# Altium schematic sheet ARD.SchDoc
size A4
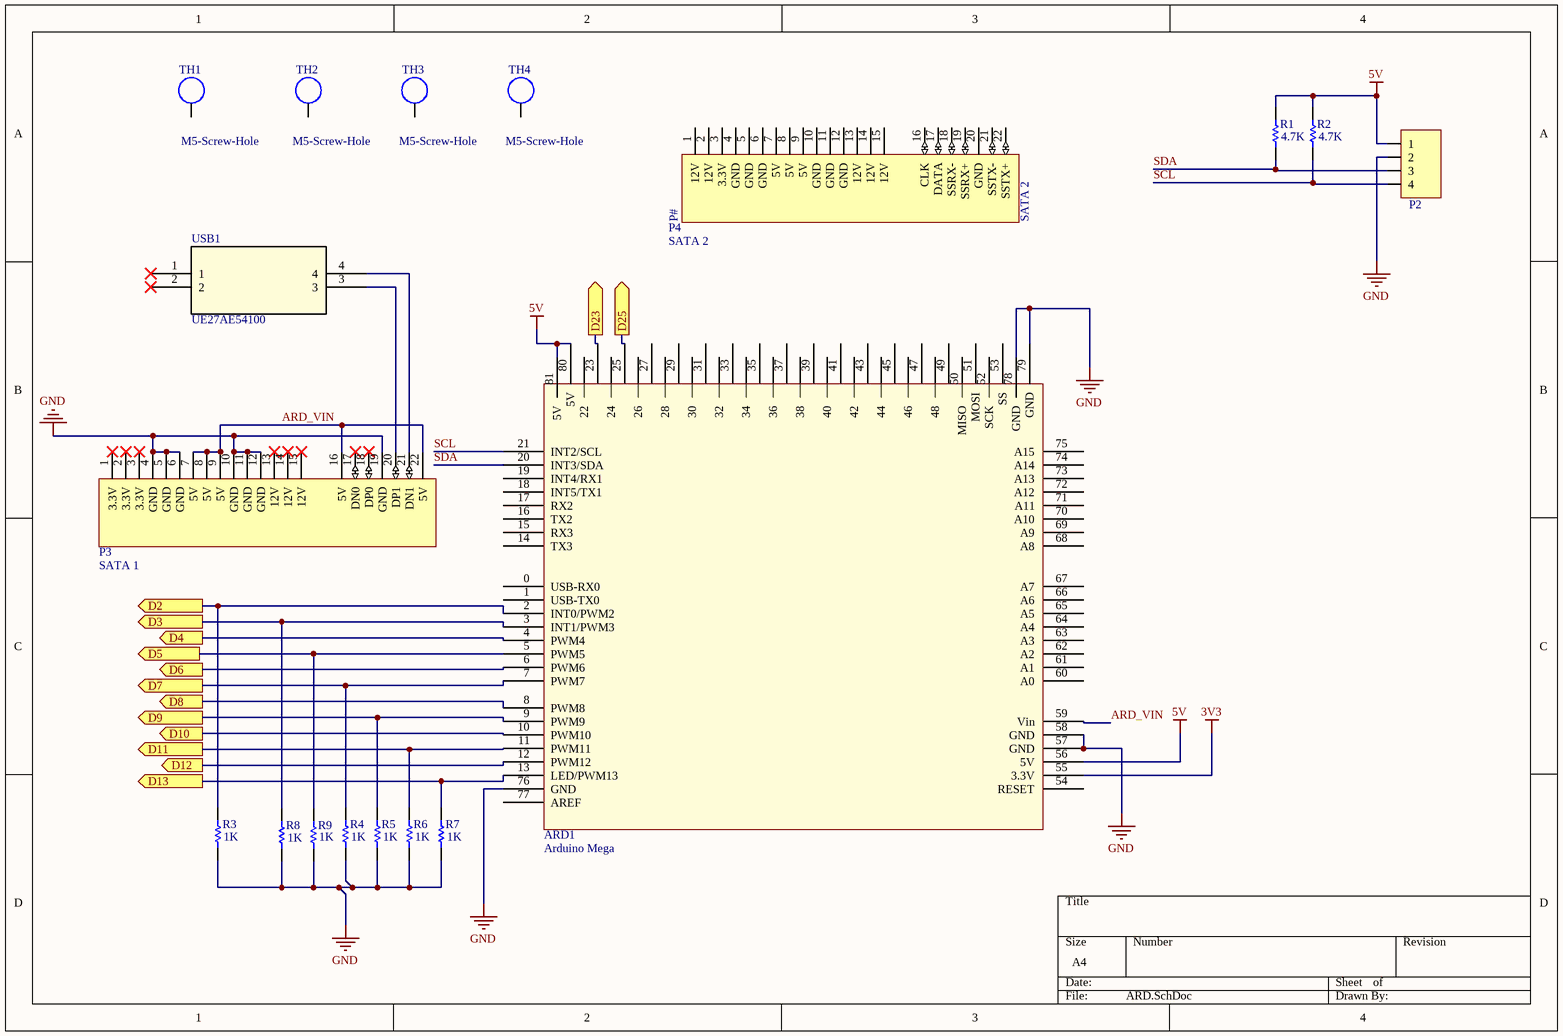
[diagram p0: ARD.SchDoc]

## Parts
ARD1  Arduino Mega  [Arduino Mega]
P2  Mini-Fit Jr 4 Pos  [MOLEX 0039281043]  (value not drawn)
P3  SATA 1  [Amphenol 10101788-002CLF]
P4  SATA 2  [Amphenol 10101788-002CLF]
R1  value 4.7K  [RESC1608X06N_0603]  (hidden comment: Res1)
R2  value 4.7K  [RESC1608X06N_0603]  (hidden comment: Res1)
R3  value 1K  [RESC1608X06N_0603]  (hidden comment: Res1)
R4  value 1K  [RESC1608X06N_0603]  (hidden comment: Res1)
R5  value 1K  [RESC1608X06N_0603]  (hidden comment: Res1)
R6  value 1K  [RESC1608X06N_0603]  (hidden comment: Res1)
R7  value 1K  [RESC1608X06N_0603]  (hidden comment: Res1)
R8  value 1K  [RESC1608X06N_0603]  (hidden comment: Res1)
R9  value 1K  [RESC1608X06N_0603]  (hidden comment: Res1)
TH1  M5-Screw-Hole  [M5_Screw_Hole]
TH2  M5-Screw-Hole  [M5_Screw_Hole]
TH3  M5-Screw-Hole  [M5_Screw_Hole]
TH4  M5-Screw-Hole  [M5_Screw_Hole]
USB1  UE27AE54100  [UE27AE54100_AMP]

## Ports
D2 (out), D3 (out), D4 (out), D5 (out), D6 (out), D7 (out), D8 (out), D9 (out), D10 (out), D11 (out), D12 (out), D13 (out), D23 (out), D25 (out)

## Nets
3V3: ARD1.55(3.3V)
5V: ARD1.56(5V) ARD1.80(5V) ARD1.81(5V) P2.1 R1.2 R2.2
GND: ARD1.57(GND) ARD1.58(GND) ARD1.76(GND) ARD1.78(GND) ARD1.79(GND) P2.2 P3.4(GND) P3.5(GND) P3.6(GND) P3.10(GND) P3.11(GND) P3.12(GND) P3.19(GND) R3.1 R4.1 R5.1 R6.1 R7.1 R8.1 R9.1
ARD_VIN: ARD1.59(Vin) P3.7(5V) P3.8(5V) P3.9(5V) P3.16(5V) P3.22(5V)
D2: ARD1.2(INT0/PWM2) R3.2 ; port D2
D3: ARD1.3(INT1/PWM3) R8.2 ; port D3
D4: ARD1.4(PWM4) ; port D4
D5: ARD1.5(PWM5) R9.2 ; port D5
D6: ARD1.6(PWM6) ; port D6
D7: ARD1.7(PWM7) R4.2 ; port D7
D8: ARD1.8(PWM8) ; port D8
D9: ARD1.9(PWM9) R5.2 ; port D9
D10: ARD1.10(PWM10) ; port D10
D11: ARD1.11(PWM11) R6.2 ; port D11
D12: ARD1.12(PWM12) ; port D12
D13: ARD1.13(LED/PWM13) R7.2 ; port D13
D23: ARD1.23 ; port D23
D25: ARD1.25 ; port D25
SCL: ARD1.21(INT2/SCL) P2.4 R2.1
SDA: ARD1.20(INT3/SDA) P2.3 R1.1
NetP3_20: P3.20(DP1) USB1.3
NetP3_21: P3.21(DN1) USB1.4

Not connected (* = marked no-connect by the designer): ARD1 0(USB-RX0) 1(USB-TX0) 14(TX3) 15(RX3) 16(TX2) 17(RX2) 18(INT5/TX1) 19(INT4/RX1) 22 24 26 27 28 29 30 31 32 33 34 35 36 37 38 39 40 41 42 43 44 45 46 47 48 49 50(MISO) 51(MOSI) 52(SCK) 53(SS) 54(RESET) 60(A0) 61(A1) 62(A2) 63(A3) 64(A4) 65(A5) 66(A6) 67(A7) 68(A8) 69(A9) 70(A10) 71(A11) 72(A12) 73(A13) 74(A14) 75(A15) 77(AREF); P3 1(3.3V)* 2(3.3V)* 3(3.3V)* 13(12V)* 14(12V)* 15(12V)* 17(DN0)* 18(DP0)*; P4 1(12V) 2(12V) 3(3.3V) 4(GND) 5(GND) 6(GND) 7(5V) 8(5V) 9(5V) 10(GND) 11(GND) 12(GND) 13(12V) 14(12V) 15(12V) 16(CLK) 17(DATA) 18(SSRX-) 19(SSRX+) 20(GND) 21(SSTX-) 22(SSTX+); TH1 1; TH2 1; TH3 1; TH4 1; USB1 1* 2*

## Notes on the sheet
- (in symbol SATA 2) P#

## Library data of the parts
P2 = Molex 0039281043: Mini-Fit Jr. Header, Dual Row, Right-Angle, with Snap-in Plastic Peg PCB Lock, 6 Circuits, PA Polyamide Nylon 6/6 94V-2, 0.76µm Select Gold (Au) Plating
P3 = SATA 1: SATA connector. / Connector 1 for option 1 as per Spec; Supplier 1: Digi-Key
P4 = SATA 2: SATA connector. / Connector 2 for option 1 as per Spec; Supplier 1: Digi-Key
R1-R9 = Res1: Resistor; Published: 8-Jun-2000; LatestRevisionDate: 17-Jul-2002; LatestRevisionNote: Re-released for DXP Platform.; PackageReference: AXIAL-0.3; Publisher: Altium Limited; PackageDescription: Axial Device, Thru-Hole; 2 Leads; 0.3 in Pin Spacing
USB1 = UE27AE54100: No Description Available; Mfr_Name: Amphenol ICC; Copyright: Copyright (C) 2022 Ultra Librarian. All rights reserved.; Manufacturer_Part_Number: UE27AE54100; Digi-Key_Part_Number_1: UE27AE54100-ND; Digi-Key_Part_Number_2: UE27AE54100-NDL; RefDes: RefDes; Type: DEV